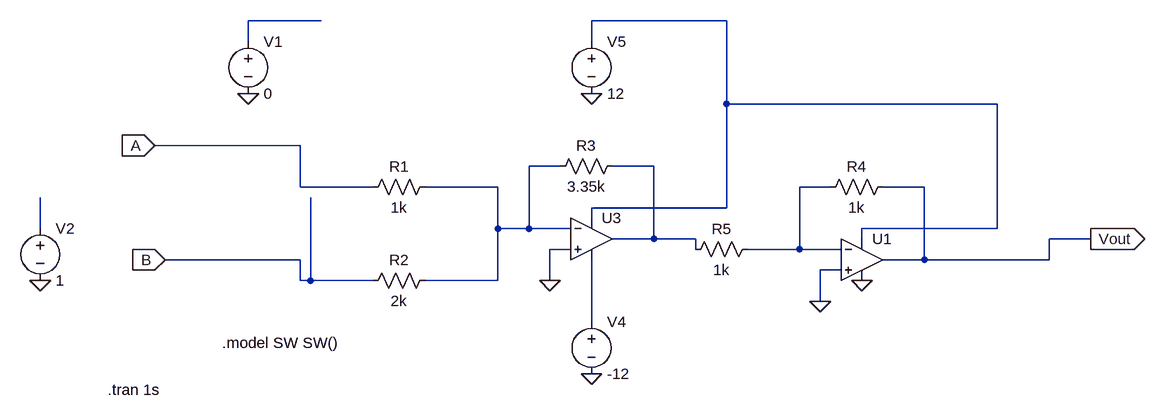
[diagram p0: schematic DAC.asc]
DAC.asc, the LTspice schematic file:
Version 4
SHEET 1 1184 680
WIRE -112 -160 -224 -160
WIRE 512 -160 304 -160
WIRE -224 -128 -224 -160
WIRE 304 -128 304 -160
WIRE 512 -32 512 -160
WIRE 928 -32 512 -32
WIRE -144 32 -368 32
WIRE 256 64 208 64
WIRE 400 64 336 64
WIRE -144 96 -144 32
WIRE -32 96 -144 96
WIRE 160 96 48 96
WIRE 672 96 624 96
WIRE 816 96 752 96
WIRE 512 128 512 -32
WIRE 512 128 304 128
WIRE 304 144 304 128
WIRE -544 160 -544 112
WIRE 160 160 160 96
WIRE 208 160 208 64
WIRE 208 160 160 160
WIRE 272 160 208 160
WIRE 928 160 928 -32
WIRE 928 160 720 160
WIRE 400 176 400 64
WIRE 400 176 336 176
WIRE 464 176 400 176
WIRE 720 176 720 160
WIRE 1072 176 1008 176
WIRE 272 192 240 192
WIRE 464 192 464 176
WIRE 624 192 624 96
WIRE 624 192 544 192
WIRE 688 192 624 192
WIRE -144 208 -352 208
WIRE 816 208 816 96
WIRE 816 208 752 208
WIRE 1008 208 1008 176
WIRE 1008 208 816 208
WIRE 688 224 656 224
WIRE -144 240 -144 208
WIRE -128 240 -128 112
WIRE -128 240 -144 240
WIRE -32 240 -128 240
WIRE 160 240 160 160
WIRE 160 240 48 240
WIRE 240 240 240 192
WIRE 656 272 656 224
WIRE 304 304 304 208
FLAG 240 240 0
FLAG 1072 176 Vout
IOPIN 1072 176 Out
FLAG -368 32 A
IOPIN -368 32 In
FLAG -352 208 B
IOPIN -352 208 In
FLAG 304 -48 0
FLAG 656 272 0
FLAG 720 240 0
FLAG 304 384 0
FLAG -224 -48 0
FLAG -544 240 0
SYMBOL res 64 80 R90
WINDOW 0 0 56 VBottom 2
WINDOW 3 32 56 VTop 2
SYMATTR InstName R1
SYMATTR Value 1k
SYMBOL res 64 224 R90
WINDOW 0 0 56 VBottom 2
WINDOW 3 32 56 VTop 2
SYMATTR InstName R2
SYMATTR Value 2k
SYMBOL res 352 48 R90
WINDOW 0 0 56 VBottom 2
WINDOW 3 32 56 VTop 2
SYMATTR InstName R3
SYMATTR Value 3.35k
SYMBOL voltage 304 -144 R0
WINDOW 123 0 0 Left 0
WINDOW 39 0 0 Left 0
SYMATTR InstName V5
SYMATTR Value 12
SYMBOL Opamps\\UniversalOpamp2 304 176 R0
SYMATTR InstName U3
SYMBOL res 768 80 R90
WINDOW 0 0 56 VBottom 2
WINDOW 3 32 56 VTop 2
SYMATTR InstName R4
SYMATTR Value 1k
SYMBOL Opamps\\UniversalOpamp2 720 208 R0
SYMATTR InstName U1
SYMBOL res 560 176 R90
WINDOW 0 0 56 VBottom 2
WINDOW 3 32 56 VTop 2
SYMATTR InstName R5
SYMATTR Value 1k
SYMBOL voltage 304 288 R0
WINDOW 123 0 0 Left 0
WINDOW 39 0 0 Left 0
SYMATTR InstName V4
SYMATTR Value -12
SYMBOL voltage -224 -144 R0
WINDOW 123 0 0 Left 0
WINDOW 39 0 0 Left 0
SYMATTR InstName V1
SYMATTR Value 0
SYMBOL voltage -544 144 R0
WINDOW 123 0 0 Left 0
WINDOW 39 0 0 Left 0
SYMATTR InstName V2
SYMATTR Value 1
TEXT -264 336 Left 2 !.model SW SW()
TEXT -440 408 Left 2 !.tran 1s

The netlist it stands for:
* DAC.asc
R1 N003 A 1k
R2 N003 B 2k
R3 N004 N003 3.35k
V5 N002 0 12
XU3 0 N003 N002 N007 N004 level.2 Avol=1Meg GBW=10Meg Slew=10Meg ilimit=25m rail=0 Vos=0 phimargin=45 en=0 enk=0 in=0 ink=0 Rin=500Meg  ; pins IN+ IN- V+ V- OUT
R4 Vout N005 1k
XU1 0 N005 N002 0 Vout level.2 Avol=1Meg GBW=10Meg Slew=10Meg ilimit=25m rail=0 Vos=0 phimargin=45 en=0 enk=0 in=0 ink=0 Rin=500Meg  ; pins IN+ IN- V+ V- OUT
R5 N005 N004 1k
V4 N007 0 -12
V1 N001 0 0
V2 N006 0 1
.model SW SW()
.tran 1s
.lib UniversalOpamps2.sub
.backanno
.end